# Altium schematic sheet lab2_shkabara_boost.SchDoc: =title_line_1 + title_line_2
size 594 x 420 mm; SheetNumber: n
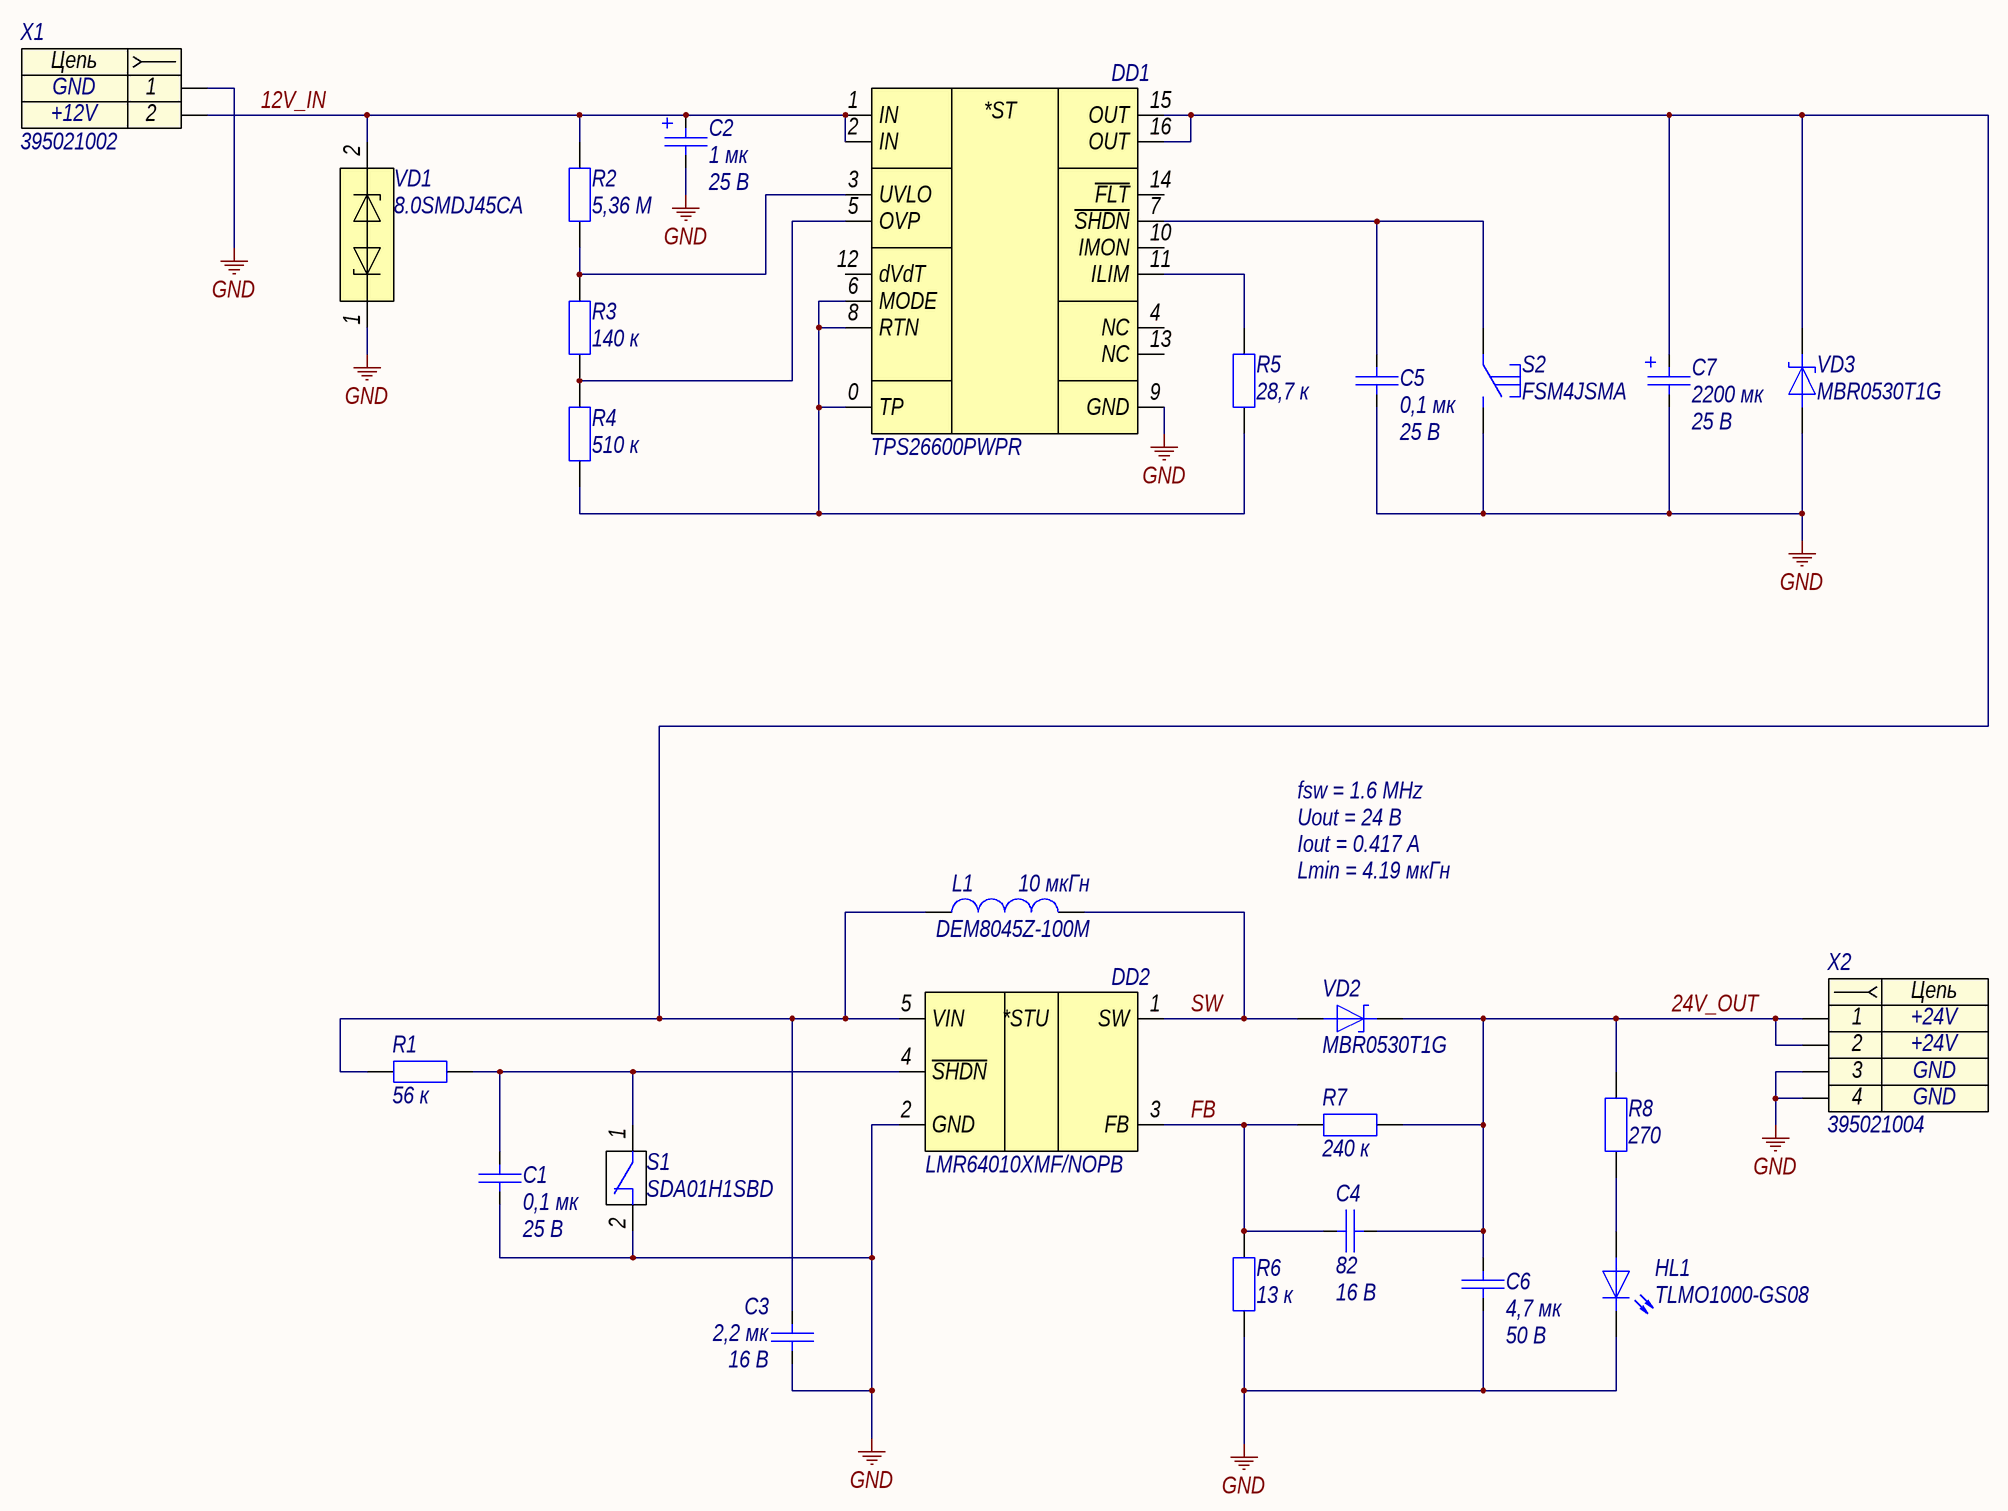
[diagram p0: lab2_shkabara_boost.SchDoc]

## Parts
C1  0,1 мк  Напряжение: 25 В  [C0402]
C2  1 мк  Напряжение: 25 В  [C1206POLAR]
C3  2,2 мк  Напряжение: 16 В  [C0603]
C4  82  Напряжение: 16 В  [C0603]
C5  0,1 мк  Напряжение: 25 В  [C0402]
C6  4,7 мк  Напряжение: 50 В  [C0805]
C7  2200 мк  Напряжение: 25 В  [CAPAE-1600X1600X2100]
DD1  TPS26600PWPR  [HTSSOP-16]
DD2  LMR64010XMF/NOPB  [SOT-23-5]
HL1  TLMO1000-GS08  [HL0603]
L1  DEM8045Z-100M  Индуктивность: 10 мкГн  [DEM-2-800X800X450]
R1  56 к  [R0603]
R2  5,36 M  [R0603]
R3  140 к  [R0603]
R4  510 к  [R0603]
R5  28,7 к  [R0603]
R6  13 к  [R0603]
R7  240 к  [R0603]
R8  270  [R0603]
S1  SDA01H1SBD  [DIP-SWITCH-01-452X930X545]
S2  FSM4JSMA  [FSM4JSMA]
VD1  8.0SMDJ45CA  [DO-214AB]
VD2  MBR0530T1G  [SOD-123]
VD3  MBR0530T1G  [SOD-123]
X1  395021002  [395021002]
X2  395021004  [395021004]

## Nets
GND: C1.2 C2.2 C3.2 C5.2 C6.2 C7.2 DD1.9(GND) DD2.2(GND) HL1.1 R6.1 S1.2 S2.2 VD1.1 VD3.2 X1.1 X2.3 X2.4
12V_IN: C2.1 DD1.1(IN) DD1.2(IN) R2.2 VD1.2 X1.2
24V_OUT: C4.1 C6.1 R7.2 R8.2 VD2.1 X2.1 X2.2
FB: C4.2 DD2.3(FB) R6.2 R7.1
SW: DD2.1(SW) L1.2 VD2.2
NetC1_1: C1.1 DD2.4(~{SHDN}) R1.1 S1.1
NetC3_1: C3.1 C7.1 DD1.15(OUT) DD1.16(OUT) DD2.5(VIN) L1.1 R1.2 VD3.1
NetC5_1: C5.1 DD1.7(~{SHDN}) S2.1
NetDD1_0: DD1.0(TP) DD1.6(MODE) DD1.8(RTN) R4.1 R5.1
NetDD1_3: DD1.3(UVLO) R2.1 R3.2
NetDD1_5: DD1.5(OVP) R3.1 R4.2
NetDD1_11: DD1.11(ILIM) R5.2
NetHL1_2: HL1.2 R8.1

Not connected (* = marked no-connect by the designer): DD1 4(NC) 10(IMON) 12(dVdT) 13(NC) 14(~{FLT})

## Notes on the sheet
- fsw = 1.6 MHz
- Uout = 24 В
- Iout = 0.417 A
- Lmin = 4.19 мкГн
- Перв. примен.
- Справ. №
- Подп. и дата
- Инв. № дубл.
- Нормоконтроль:
- Взам. инв. №
- Изм.
- Лист
- № докум.
- Подп.
- Дата
- Лит.
- Масса
- Масштаб
- Т.контр.
- Пров.
- Разраб.
- Листов
- Разработал:
- Инв. № подл.
- Н.контр.
- Утв.
- Копировал
- Формат
- А2
- (in symbol dd0001) *ST
- (in symbol dd0008) *STU
- (in symbol x0008) Цепь
- (in symbol x0009) Цепь

## Library data of the parts
C1 = c0021: =Описание; ID: c0021; Фамилия: Паньков; Описание: Конденсатор чип 0402 0,1 мкФ 25 В ±10 %; Наименование: CC0402KRX5R8BB104; Производитель: YAGEO Corp.; Отклонение: ±10 %; Рабочие температуры: от –55 °С до +85 °С; ТКЕ: X5R; Корпус: 0402; Номинал: 0,1 мк; Номинальное напряжение: 25 В; HelpURL: https://www.yageo.com/upload/media/product/productsearch/datasheet/mlcc/UPY-GPHC_X5R_4V-to-50V_26.pdf
C2 = c0117: =Описание; ID: c0117; Фамилия: Ларионов; Описание: Конденсатор чип 1206 1 мкФ 25 В ±10 % полярный; Наименование: 293D105X9025A2TE3; Производитель: Vishay Intertechnology, Inc.; Отклонение: ±10 %; Рабочие температуры: от –55 °С до +125 °С; Корпус: 1206; Номинал: 1 мк; Номинальное напряжение: 25 В; Температурный коэффициент емкости: -; HelpURL: https://www.vishay.com/capacitors/list/product-40002/
C3 = c0061: =Описание; ID: c0061; Фамилия: Паньков; Описание: Конденсатор чип 0603 2,2 мкФ 16 В ±10 %; Наименование: CC0603KRX5R7BB225; Производитель: YAGEO Corp.; Отклонение: ±10 %; Рабочие температуры: от –55 °С до +85 °С; ТКЕ: X5R; Корпус: 0603; Номинал: 2,2 мк; Номинальное напряжение: 16 В; HelpURL: https://www.yageo.com/upload/media/product/productsearch/datasheet/mlcc/UPY-GPHC_X5R_4V-to-50V_26.pdf
C4 = c0011: =Описание; ID: c0011; Фамилия: Ларионов; Описание: Конденсатор чип 0603 82 пФ 16 В ±5 %; Наименование: CC0603JRNPO7BN820; Производитель: YAGEO Corp.; Отклонение: ±5 %; Рабочие температуры: от –55 °С до +125 °С; Температурный коэффициент емкости: C0G; Корпус: 0603; Номинал: 82; Номинальное напряжение: 16 В; HelpURL: https://www.yageo.com/upload/media/product/productsearch/datasheet/mlcc/UPY-GP_NP0_16V-to-50V_18.pdf
C5 = c0031: =Описание; ID: c0031; Фамилия: Паньков; Описание: Конденсатор чип 0402 100 нФ 25 В ±10 %; Наименование: CC0402KRX5R8BB104; Производитель: YAGEO Corp.; Отклонение: ±10 %; Рабочие температуры: от –55 °С до +85 °С; Температурный коэффициент емкости: X5R; Корпус: 0402; Номинал: 0,1 мк; Номинальное напряжение: 25 В; HelpURL: https://www.yageo.com/upload/media/product/productsearch/datasheet/mlcc/UPY-GPHC_X5R_4V-to-50V_26.pdf
C6 = c0083: =Описание; ID: c0083; Фамилия: Паньков; Описание: Конденсатор чип 0805 4,7 мкФ 50 В ±10 %; Наименование: CC0805KRX5R9BB475; Производитель: YAGEO Corp.; Отклонение: ±10 %; Рабочие температуры: от –55 °С до +85 °С; Температурный коэффициент емкости: X5R; Корпус: 0603; Номинал: 4,7 мк; Номинальное напряжение: 50 В; HelpURL: https://www.yageo.com/upload/media/product/productsearch/datasheet/mlcc/UPY-GPHC_X5R_4V-to-50V_26.pdf
C7 = c0109: =Описание; ID: c0109; Фамилия: Шкабара; Описание: Конденсатор электролитический 2200 мкФ 25 В ±20 %; Наименование: MAL214699607E3; Производитель: Vishay Intertechnology, Inc.; Отклонение: ±20 %; Рабочие температуры: от –55 °С до +125 °С; Корпус: CAPAE (16 x 16 x 21); Номинал: 2200 мк; Номинальное напряжение: 25 В; Температурный коэффициент емкости: -; HelpURL: https://www.vishay.com/capacitors/list/product-28403/
DD1 = dd0001: =Описание; ID: dd0001; Фамилия: Ларионов; Описание: Защитная микросхема eFuse 60 В и 2 А; Производитель: Texas Instruments; Напряжение: от 4,2 В до 60 В; Максимальное напряжение: 62 В; Ток: от 0,1 А до 2,23 А; Рабочие температуры: от -40 °С до +125 °С; Наименование: TPS26600PWPR; Корпус: HTSSOP-16; HelpURL: https://www.ti.com/product/TPS2660
DD2 = dd0008: =Описание; ID: dd0008; Фамилия: Шкабара; Описание: Повышающий преобразователь напряжения 40 В и 1 А; Производитель: Texas Instruments; Входное напряжение: от 2,7 В до 14 В; Выходное напряжение: от 3 В до 40 В; Коммутируемый ток: от 0 А до 1 А; Частота переключения: 1,6 МГц; Рабочие температуры: от -40 °С до +125 °С; Наименование: LMR64010XMF/NOPB; Корпус: SOT-23-5; HelpURL: https://www.ti.com/product/LMR64010
HL1 = hl0002: =Описание; ID: hl0002; Фамилия: Ларионов; Описание: Светодиод чип 0603 светло-оранжевый; Производитель: Vishay Intertechnology, Inc.; Цвет: Soft orange; Номинальная сила света: 7,5 мкд; Номинальная длина волны: 605 нм; Номинальный прямой ток: 15 мА; Номинальное падение напряжения: 1,8 В; Рассеиваемая мощность: 40 мВт; Рабочие температуры: от –40 °С до +100 °С; Корпус: 0603; Наименование: TLMO1000-GS08; HelpURL: https://www.vishay.com/leds/list/product-83172/
L1 = l0005: =Описание; ID: l0005; Фамилия: Паньков; Описание: Катушка индуктивности 10 мкГн ±20 %; Производитель: Murata Manufacturing Co., Ltd.; Отклонение: ±20 %; Номинальное активное сопротивление: 33 мОм; Максимальное активное сопротивление: 39,6 мОм; Резонансная частота: 24 МГц; Номинальный ток (при нагреве на 20 °С/40 °С): 3,9 А; Ток насыщения: 4,3 А; Рабочее напряжение: не указано; Рабочие температуры: от –40 °С до +125 °С; Корпус: 8,0 x 8,0 x 4,5; Наименование: DEM8045Z-100M; Номинал: 10 мкГн; HelpURL: https://www.murata.com/en-us/products/productdetail?partno=DEM8045Z-100M%23
R1 = r0085: =Описание; ID: r0085; Фамилия: Паньков; Описание: Резистор чип 0603 56 кОм ±1 % 0,1 Вт; Наименование: RC0603FR-0756KL; Производитель: YAGEO Corp.; Отклонение: ±1 %; Номинальное напряжение: 75 В; Рабочие температуры: от –55 °С до +155 °С; Номинальный ток: 1 А; Корпус: 0603; Номинал: 56 к; HelpURL: https://www.yageo.com/upload/media/product/productsearch/datasheet/rchip/PYu-RC_Group_51_RoHS_L_11.pdf
R2 = r0128: =Описание; ID: r0128; Фамилия: Шкабара; Описание: Резистор чип 0603 5,36 МОм ±1 % 0,1 Вт; Наименование: RC0603FR-075M36L; Производитель: YAGEO Corp.; Отклонение: ±1 %; Номинальное напряжение: 75 В; Рабочие температуры: от –55 °С до +155 °С; Номинальный ток: 1 А; Корпус: 0603; Номинал: 5,36 M; HelpURL: https://www.yageo.com/upload/media/product/productsearch/datasheet/rchip/PYu-RC_Group_51_RoHS_L_11.pdf
R3 = r0099: =Описание; ID: r0099; Фамилия: Шкабара; Описание: Резистор чип 0603 140 кОм ±1 % 0,1 Вт; Наименование: RC0603FR-07140KL; Производитель: YAGEO Corp.; Отклонение: ±1 %; Номинальное напряжение: 75 В; Рабочие температуры: от –55 °С до +155 °С; Номинальный ток: 1 А; Корпус: 0603; Номинал: 140 к; HelpURL: https://www.yageo.com/upload/media/product/productsearch/datasheet/rchip/PYu-RC_Group_51_RoHS_L_11.pdf
R4 = r0116: =Описание; ID: r0116; Фамилия: Паньков; Описание: Резистор чип 0603 510 кОм ±1 % 0,1 Вт; Наименование: RC0603FR-07510KL; Производитель: YAGEO Corp.; Отклонение: ±1 %; Номинальное напряжение: 75 В; Рабочие температуры: от –55 °С до +155 °С; Номинальный ток: 1 А; Корпус: 0603; Номинал: 510 к; HelpURL: https://www.yageo.com/upload/media/product/productsearch/datasheet/rchip/PYu-RC_Group_51_RoHS_L_11.pdf
R5 = r0075: =Описание; ID: r0075; Фамилия: Шкабара; Описание: Резистор чип 0603 28,7 кОм ±1 % 0,1 Вт; Наименование: RC0603FR-0728K7L; Производитель: YAGEO Corp.; Отклонение: ±1 %; Номинальное напряжение: 75 В; Рабочие температуры: от –55 °С до +155 °С; Номинальный ток: 1 А; Корпус: 0603; Номинал: 28,7 к; HelpURL: https://www.yageo.com/upload/media/product/productsearch/datasheet/rchip/PYu-RC_Group_51_RoHS_L_11.pdf
R6 = r0065: =Описание; ID: r0065; Фамилия: Жернаков; Описание: Резистор чип 0603 13 кОм ±1 % 0,1 Вт; Наименование: RC0603FR-0713KL; Производитель: YAGEO Corp.; Отклонение: ±1 %; Номинальное напряжение: 75 В; Рабочие температуры: от –55 °С до +155 °С; Номинальный ток: 1 А; Корпус: 0603; Номинал: 13 к; HelpURL: https://www.yageo.com/upload/media/product/productsearch/datasheet/rchip/PYu-RC_Group_51_RoHS_L_11.pdf
R7 = r0106: =Описание; ID: r0106; Фамилия: Паньков; Описание: Резистор чип 0603 240 кОм ±1 % 0,1 Вт; Наименование: RC0603FR-07240KL; Производитель: YAGEO Corp.; Отклонение: ±1 %; Номинальное напряжение: 75 В; Рабочие температуры: от –55 °С до +155 °С; Номинальный ток: 1 А; Корпус: 0603; Номинал: 240 к; HelpURL: https://www.yageo.com/upload/media/product/productsearch/datasheet/rchip/PYu-RC_Group_51_RoHS_L_11.pdf
R8 = r0017: =Описание; ID: r0017; Фамилия: Паньков; Описание: Резистор чип 0603 270 Ом ±1 % 0,1 Вт; Наименование: RC0603FR-07270RL; Производитель: YAGEO Corp.; Отклонение: ±1 %; Номинальное напряжение: 75 В; Рабочие температуры: от –55 °С до +155 °С; Номинальный ток: 1 А; Корпус: 0603; Номинал: 270; HelpURL: https://www.yageo.com/upload/media/product/productsearch/datasheet/rchip/PYu-RC_Group_51_RoHS_L_11.pdf
S1 = sw0002: =Описание; ID: sw0002; Фамилия: Паньков; Описание: 2-х позиционный движковый переключатель; Производитель: C&K; Ток нагрузки: 100 мА @ 5 В; Сопротивление контакта: 50 мОм; Количество контактов: 2; Рабочие температуры: от –40 °С до +85 °С; Промывка: Разрешена; Корпус: 4,52х9,30х5,45; Наименование: SDA01H1SBD; HelpURL: https://www.ckswitches.com/products/switches/product-details/DIP/SDA/SDA01H1SBD/
S2 = sw0001: =Описание; ID: sw0001; Фамилия: Паньков; Описание: Тактовая кнопка поверхностного монтажа; Производитель: TE Connectivity; Ток нагрузки: 50 мА @ 24 В; Сопротивление контакта: 100 мОм; Количество контактов: 4; Рабочие температуры: от –35 °С до +85 °С; Промывка: Разрешена; Корпус: 6,00x6,00x4,98; Наименование: FSM4JSMA; HelpURL: https://www.te.com/usa-en/product-4-1437565-1.html
VD1 = vd0005: =Описание; ID: vd0005; Фамилия: Шкабара; Описание: Двунаправленная диодная сборка для подавления помех, 45 В; Производитель: Littelfuse, Inc.; Наименование: 8.0SMDJ45CA; Корпус: DO-214AB; HelpURL: https://www.littelfuse.com/products/tvs-diodes/surface-mount/8.0smdj.aspx
VD2 VD3 = vd0001: =Описание; ID: vd0001; Фамилия: Шкабара; Описание: Диод Шоттки 30 В 0,5 А; Производитель: ON Semiconductor; Пиковое прямое напряжение: 0,43 В; Импульсное обратное напряжение: 30 В; Макс допустимый средний прямой ток: 0,5 А; Рабочие температуры: от –65 °С до +125 °С; Наименование: MBR0530T1G; Корпус: SOD-123; HelpURL: https://www.onsemi.com/products/discretes-drivers/diodes-rectifiers/schottky-diodes-schottky-rectifiers/mbr0530t1g
X1 = x0008: =Описание; Contact_1: GND; Contact_2: +12V; ID: x0008; Фамилия: Шкабара; Описание: Eurostyle terminal block 2 pin 3,5 мм гнездо угловой; Производитель: Molex Incorporated; Наименование: 395021002; HelpURL: https://www.molex.com/molex/products/part-detail/terminal_blocks/0395021002
X2 = x0009: =Описание; Contact_1: +24V; Contact_3: GND; ID: x0009; Фамилия: Шкабара; Описание: Eurostyle terminal block 4 pin 3,5 мм гнездо угловой; Производитель: Molex Incorporated; Contact_2: +24V; Contact_4: GND; Наименование: 395021004; HelpURL: https://www.molex.com/molex/products/part-detail/terminal_blocks/0395021004